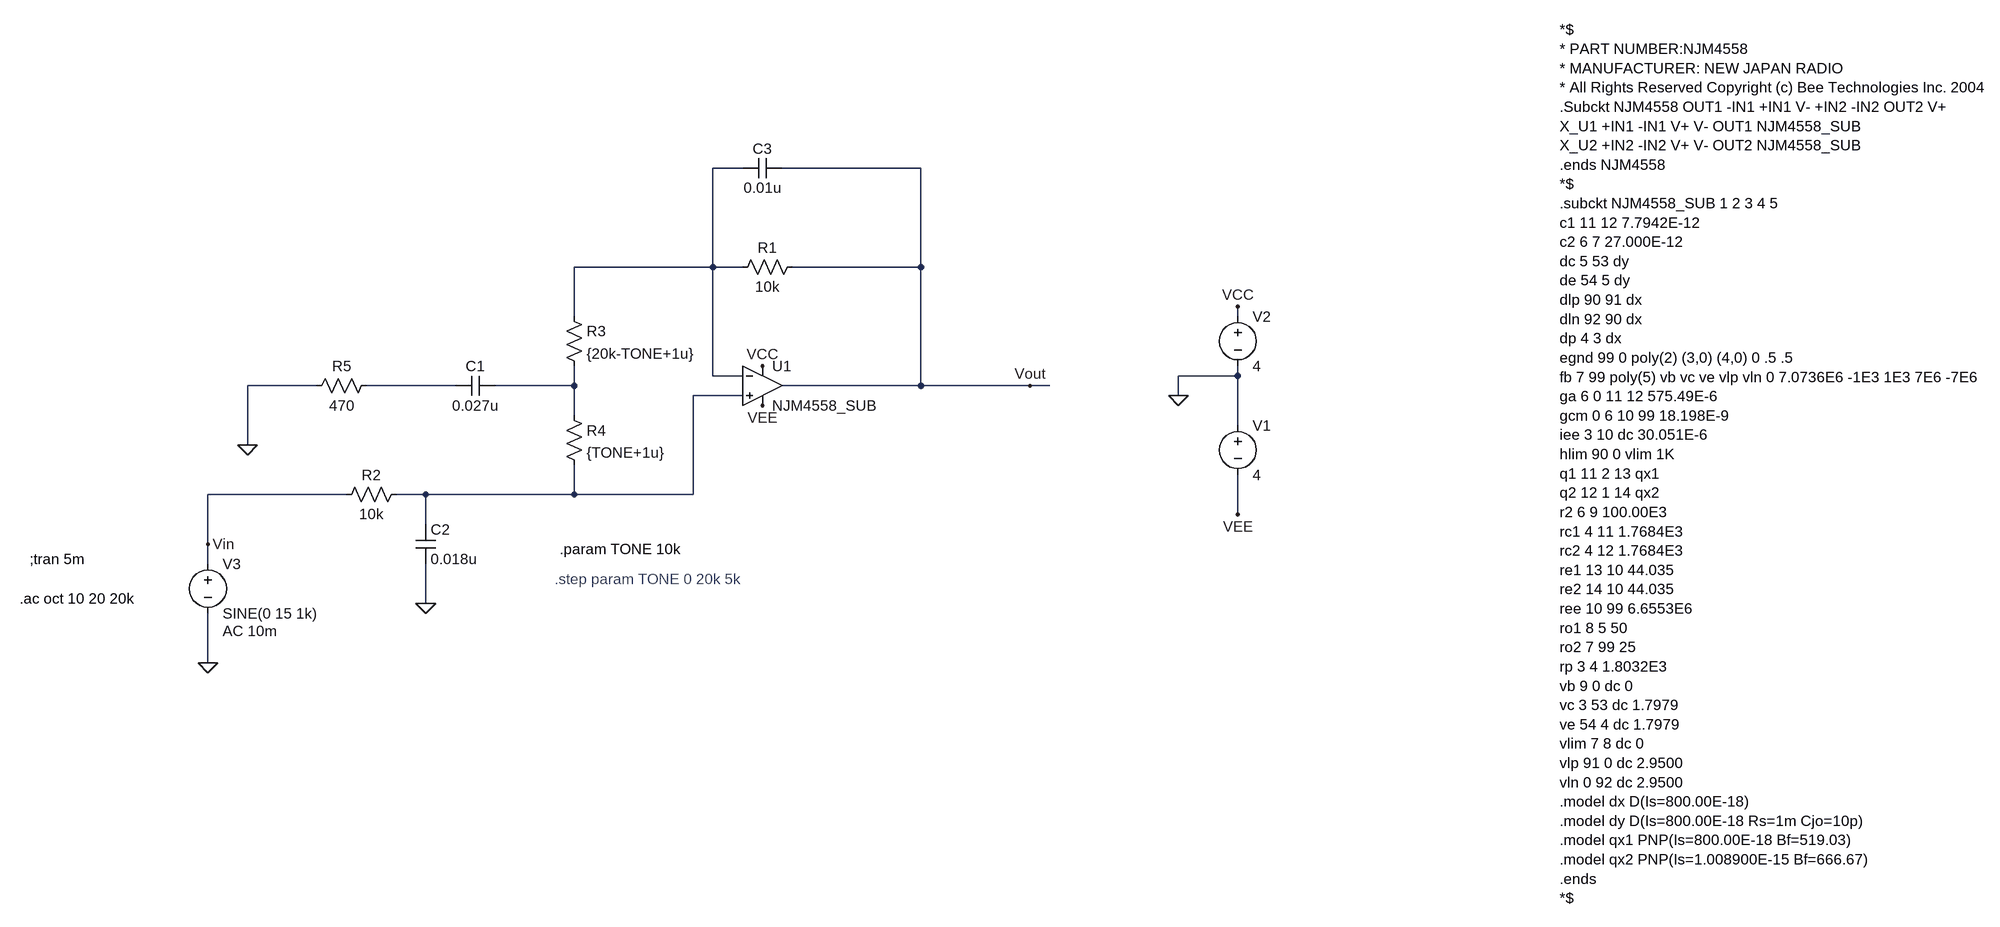
[diagram p0: schematic SD-1_TONE (1).asc]
SD-1_TONE (1).asc, the LTspice schematic file:
Version 4
SHEET 1 1912 1608
WIRE -224 32 -272 32
WIRE 64 32 -160 32
WIRE -272 192 -272 32
WIRE -272 192 -496 192
WIRE -224 192 -272 192
WIRE 64 192 64 32
WIRE 64 192 -144 192
WIRE -496 272 -496 192
WIRE 576 272 576 256
WIRE -272 368 -272 192
WIRE -224 368 -272 368
WIRE 576 368 576 352
WIRE 576 368 480 368
WIRE -912 384 -1024 384
WIRE -688 384 -832 384
WIRE -496 384 -496 352
WIRE -496 384 -624 384
WIRE 64 384 64 192
WIRE 64 384 -160 384
WIRE 240 384 64 384
WIRE 272 384 240 384
WIRE -224 400 -304 400
WIRE 480 400 480 368
WIRE -496 432 -496 384
WIRE 576 448 576 368
WIRE -1024 480 -1024 384
WIRE -864 560 -1088 560
WIRE -736 560 -784 560
WIRE -496 560 -496 512
WIRE -496 560 -736 560
WIRE -304 560 -304 400
WIRE -304 560 -496 560
WIRE 576 592 576 528
WIRE -736 608 -736 560
WIRE -1088 640 -1088 560
WIRE -1088 672 -1088 640
WIRE -736 736 -736 672
WIRE -1088 832 -1088 752
FLAG -1088 832 0
FLAG 480 400 0
FLAG 576 256 VCC
FLAG -192 352 VCC
FLAG -192 416 VEE
FLAG 576 592 VEE
FLAG 240 384 Vout
FLAG -1088 640 Vin
FLAG -1024 480 0
FLAG -736 736 0
SYMBOL Opamps\\opamp2 -192 320 R0
SYMATTR InstName U1
SYMATTR Value NJM4558_SUB
SYMBOL voltage 576 432 R0
WINDOW 123 0 0 Left 2
WINDOW 39 0 0 Left 2
SYMATTR InstName V1
SYMATTR Value 4
SYMBOL voltage 576 256 R0
WINDOW 123 0 0 Left 2
WINDOW 39 0 0 Left 2
SYMATTR InstName V2
SYMATTR Value 4
SYMBOL voltage -1088 656 R0
WINDOW 123 24 124 Left 2
WINDOW 39 0 0 Left 2
SYMATTR Value2 AC 10m
SYMATTR InstName V3
SYMATTR Value SINE(0 15 1k)
SYMBOL res -128 176 R90
WINDOW 0 0 56 VBottom 2
WINDOW 3 32 56 VTop 2
SYMATTR InstName R1
SYMATTR Value 10k
SYMBOL res -768 544 R90
WINDOW 0 0 56 VBottom 2
WINDOW 3 32 56 VTop 2
SYMATTR InstName R2
SYMATTR Value 10k
SYMBOL res -512 256 R0
SYMATTR InstName R3
SYMATTR Value {20k-TONE+1u}
SYMBOL res -512 416 R0
SYMATTR InstName R4
SYMATTR Value {TONE+1u}
SYMBOL res -816 368 R90
WINDOW 0 0 56 VBottom 2
WINDOW 3 32 56 VTop 2
SYMATTR InstName R5
SYMATTR Value 470
SYMBOL cap -624 368 R90
WINDOW 0 0 32 VBottom 2
WINDOW 3 32 32 VTop 2
SYMATTR InstName C1
SYMATTR Value 0.027u
SYMBOL cap -752 608 R0
SYMATTR InstName C2
SYMATTR Value 0.018u
SYMBOL cap -160 16 R90
WINDOW 0 0 32 VBottom 2
WINDOW 3 32 32 VTop 2
SYMATTR InstName C3
SYMATTR Value 0.01u
TEXT 1096 -192 Left 2 !*$\n* PART NUMBER:NJM4558\n* MANUFACTURER: NEW JAPAN RADIO\n* All Rights Reserved Copyright (c) Bee Technologies Inc. 2004\n.Subckt NJM4558 OUT1 -IN1 +IN1 V- +IN2 -IN2 OUT2 V+\nX_U1 +IN1 -IN1 V+ V- OUT1 NJM4558_SUB\nX_U2 +IN2 -IN2 V+ V- OUT2 NJM4558_SUB\n.ends NJM4558\n*$\n.subckt NJM4558_SUB 1 2 3 4 5\nc1 11 12 7.7942E-12\nc2 6 7 27.000E-12\ndc 5 53 dy\nde 54 5 dy\ndlp 90 91 dx\ndln 92 90 dx\ndp 4 3 dx\negnd 99 0 poly(2) (3,0) (4,0) 0 .5 .5\nfb 7 99 poly(5) vb vc ve vlp vln 0 7.0736E6 -1E3 1E3 7E6 -7E6\nga 6 0 11 12 575.49E-6\ngcm 0 6 10 99 18.198E-9\niee 3 10 dc 30.051E-6\nhlim 90 0 vlim 1K\nq1 11 2 13 qx1\nq2 12 1 14 qx2\nr2 6 9 100.00E3\nrc1 4 11 1.7684E3\nrc2 4 12 1.7684E3\nre1 13 10 44.035\nre2 14 10 44.035\nree 10 99 6.6553E6\nro1 8 5 50\nro2 7 99 25\nrp 3 4 1.8032E3\nvb 9 0 dc 0\nvc 3 53 dc 1.7979\nve 54 4 dc 1.7979\nvlim 7 8 dc 0\nvlp 91 0 dc 2.9500\nvln 0 92 dc 2.9500\n.model dx D(Is=800.00E-18)\n.model dy D(Is=800.00E-18 Rs=1m Cjo=10p)\n.model qx1 PNP(Is=800.00E-18 Bf=519.03)\n.model qx2 PNP(Is=1.008900E-15 Bf=666.67)\n.ends\n*$
TEXT -1392 728 Left 2 !.ac oct 10 20 20k
TEXT -1376 664 Left 2 !;tran 5m
TEXT -520 648 Left 2 !.param TONE 10k
TEXT -528 696 Left 2 ;.step param TONE 0 20k 5k

The netlist it stands for:
* SD-1_TONE (1).asc
XU1 N004 N001 VCC VEE Vout NJM4558_SUB  ; pins In+ In- V+ V- OUT
V1 0 VEE 4
V2 VCC 0 4
V3 Vin 0 SINE(0 15 1k) AC 10m
R1 Vout N001 10k
R2 N004 Vin 10k
R3 N001 N003 {20k-TONE+1u}
R4 N003 N004 {TONE+1u}
R5 N002 0 470
C1 N003 N002 0.027u
C2 N004 0 0.018u
C3 Vout N001 0.01u
*$
* PART NUMBER:NJM4558
* MANUFACTURER: NEW JAPAN RADIO
* All Rights Reserved Copyright (c) Bee Technologies Inc. 2004
.Subckt NJM4558 OUT1 -IN1 +IN1 V- +IN2 -IN2 OUT2 V+
X_U1 +IN1 -IN1 V+ V- OUT1 NJM4558_SUB
X_U2 +IN2 -IN2 V+ V- OUT2 NJM4558_SUB
.ends NJM4558
*$
.subckt NJM4558_SUB 1 2 3 4 5
c1 11 12 7.7942E-12
c2 6 7 27.000E-12
dc 5 53 dy
de 54 5 dy
dlp 90 91 dx
dln 92 90 dx
dp 4 3 dx
egnd 99 0 poly(2) (3,0) (4,0) 0 .5 .5
fb 7 99 poly(5) vb vc ve vlp vln 0 7.0736E6 -1E3 1E3 7E6 -7E6
ga 6 0 11 12 575.49E-6
gcm 0 6 10 99 18.198E-9
iee 3 10 dc 30.051E-6
hlim 90 0 vlim 1K
q1 11 2 13 qx1
q2 12 1 14 qx2
r2 6 9 100.00E3
rc1 4 11 1.7684E3
rc2 4 12 1.7684E3
re1 13 10 44.035
re2 14 10 44.035
ree 10 99 6.6553E6
ro1 8 5 50
ro2 7 99 25
rp 3 4 1.8032E3
vb 9 0 dc 0
vc 3 53 dc 1.7979
ve 54 4 dc 1.7979
vlim 7 8 dc 0
vlp 91 0 dc 2.9500
vln 0 92 dc 2.9500
.model dx D(Is=800.00E-18)
.model dy D(Is=800.00E-18 Rs=1m Cjo=10p)
.model qx1 PNP(Is=800.00E-18 Bf=519.03)
.model qx2 PNP(Is=1.008900E-15 Bf=666.67)
.ends
*$
.ac oct 10 20 20k
;tran 5m
.param TONE 10k
* .step param TONE 0 20k 5k
.backanno
.end